# EAGLE design Adapter-IO4-200 (EAGLE 7.7.0)
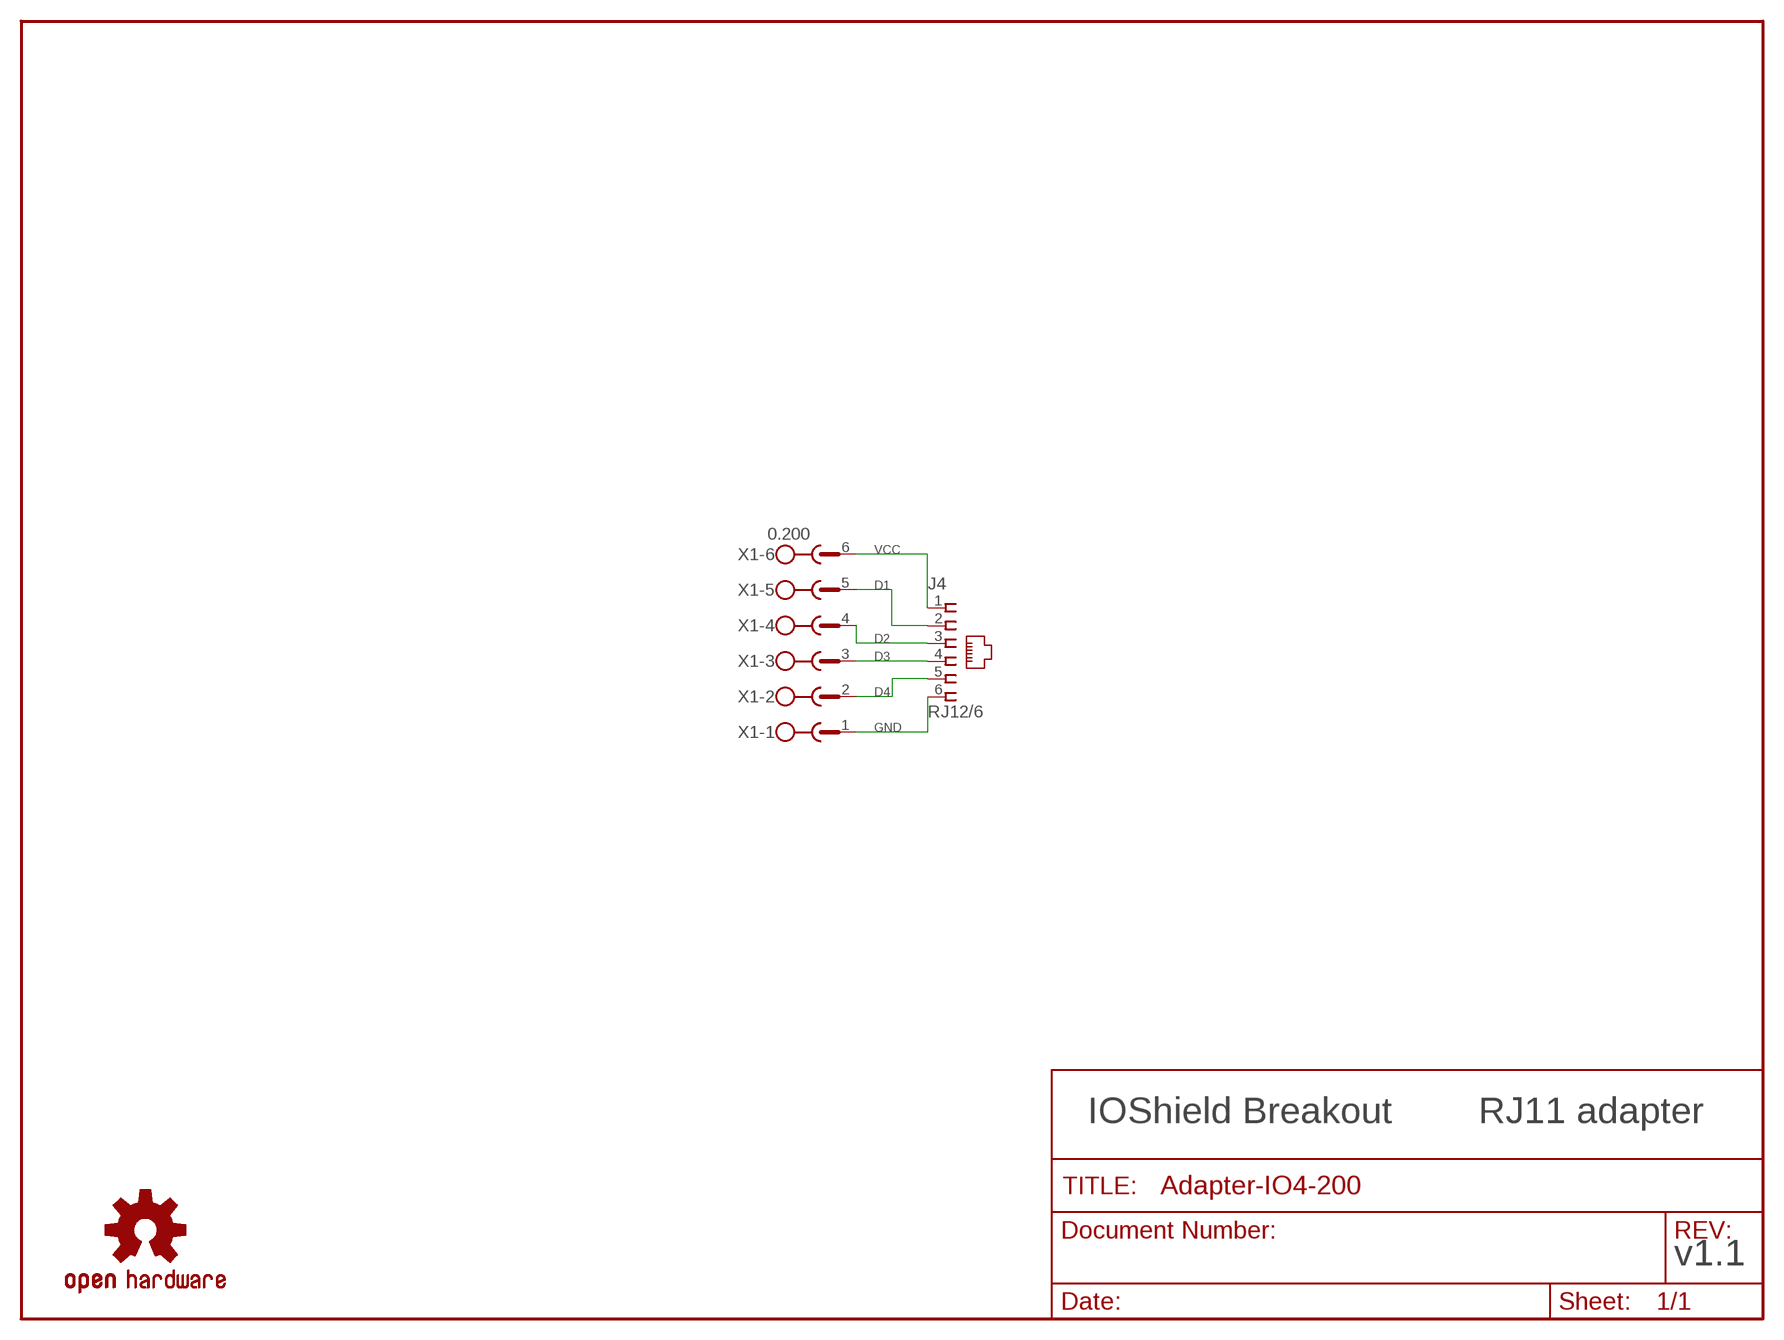
[diagram p0: schematic, sheet 1]

## Parts
J4  RJ12/6  CONNECTOR-RJ25-6P6C  [RJ25-PANEL]
U$1  OSHW  OSHW-LOGOM  [OSHW-LOGO-M]
X1  0.200  MSTBA6  [MSTBA6]

## Nets
D1: J4.2 X1.5
D2: J4.3 X1.4
D3: J4.4 X1.3
D4: J4.5 X1.2
GND [power]: J4.6 X1.1
VCC [power]: J4.1 X1.6

## Notes on the sheet
- IOShield Breakout | RJ11 adapter
- v1.1

## Library data of the parts
J4 = SPCoast:CONNECTOR-RJ25: AMP connector; AMP: 520250-3; OPL: none
U$1 = SparkFun:OSHW-LOGO: Open Source Hardware Logo This logo indicates the piece of hardware it is found on incorporates a OSHW license and/or adheres to the definition of open source hardware found here: http://freedomdefined.org/OSHW
X1 = con-phoenix-508:MSTBA6: PHOENIX; MF: FARNELL; MPN: 1757284; OC_FARNELL: 3705213; OC_NEWARK: 71C4165

## Net classes
0 default: width 0.508 mm
1 power: width 0.61 mm

## Board
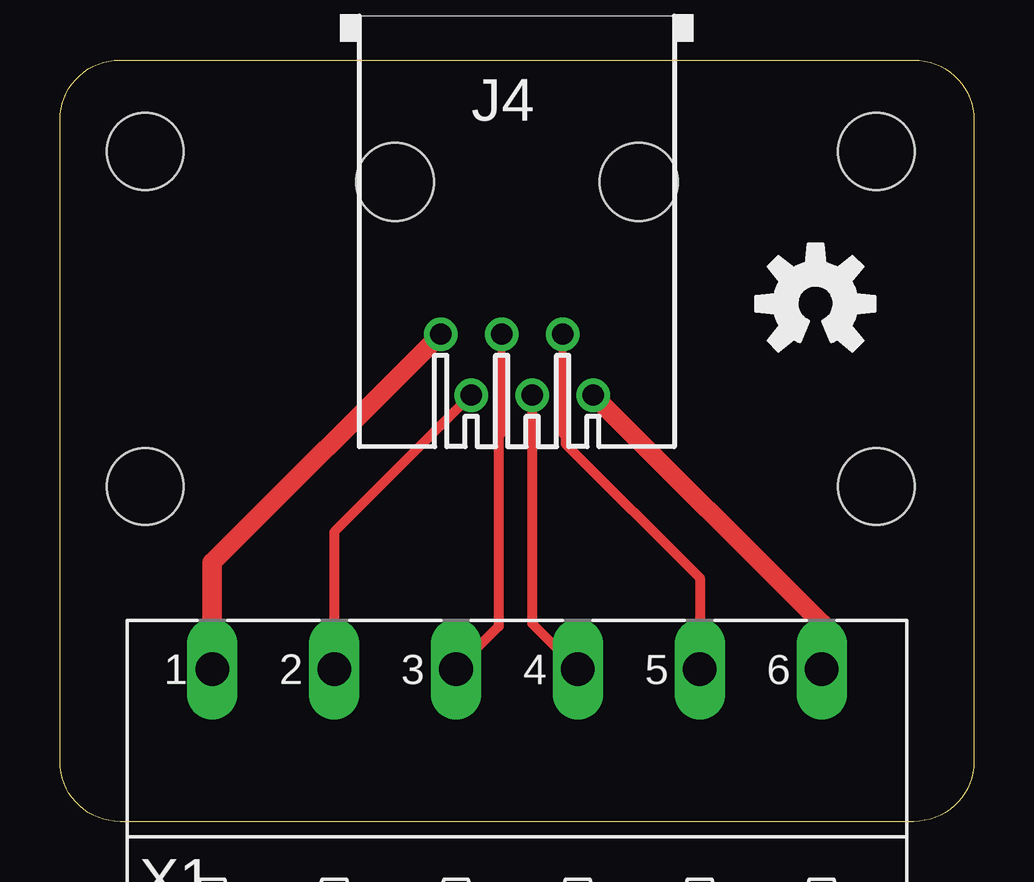
[diagram p1: board, top side]
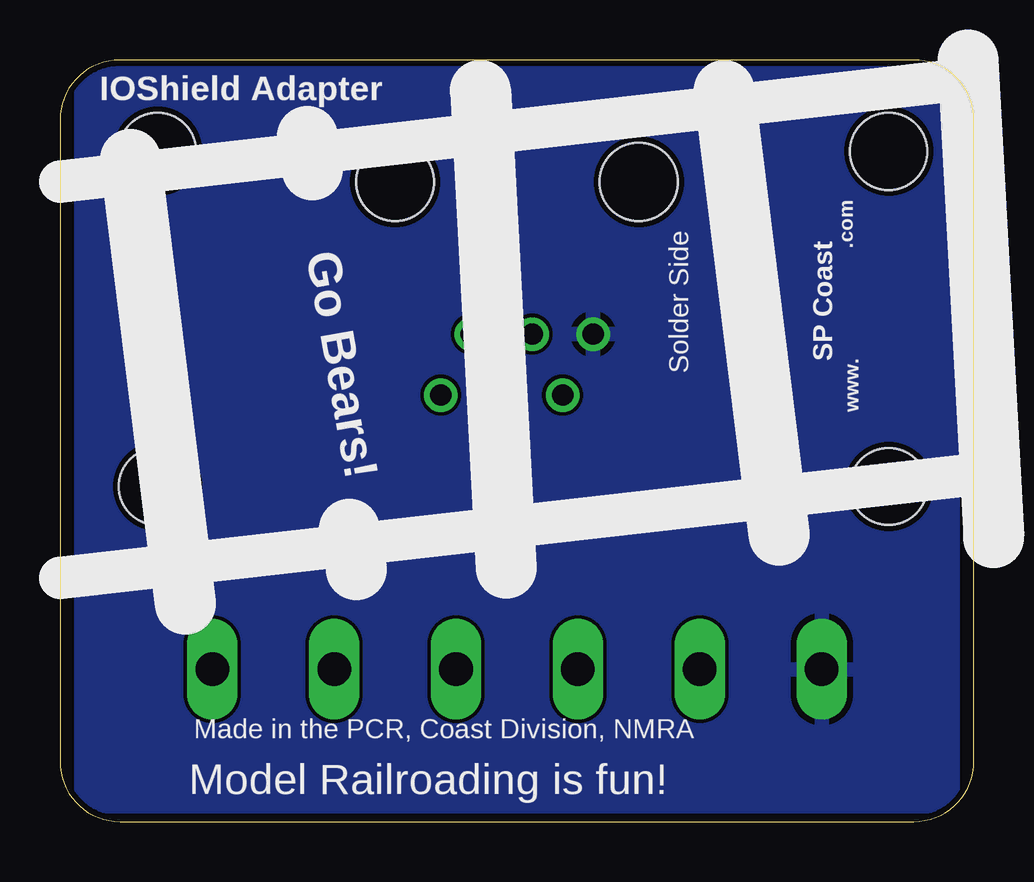
[diagram p2: board, bottom side, seen from below]

Size 38.1 x 31.75 mm. Coordinates in mm from the lower left corner, seen from the top.
Outline: 0,3.81 0,29.25 arc-90 2.5,31.75 26.67,31.75 35.6,31.75 arc-90 38.1,29.25 38.1,5.08 38.1,2.5 arc-90 35.6,0 7.62,0 2.5,0 arc-90 0,2.5 0,3.81
Copper layers (1*16): Top 0.035mm / dielectric 1.5mm / Bottom 0.035mm
Design rules "Fusion_eagle_rule_v1.1": minimum track width 6mil, minimum drill 12mil, track to track 6mil, track to pad 6mil, pad to pad 6mil, via to via 6mil, smd to smd 0mil, copper to edge 10mil, drill to drill 10mil, minimum pad ring 10mil, minimum via ring 6mil, stop-mask expansion 2mil, vias tented up to drill 100mil, thermal gap 10mil
Holes 3.2 mm at 34.04,27.94 3.56,27.94 3.56,13.97 34.04,13.97

### Footprints (pad centres in the part's own frame; a part is rotated, then mirrored left to right if it is on the bottom)
RJ25-PANEL = drill 0.889: 1 -3.175,8.89; 2 -1.905,6.35; 3 -0.635,8.89; 4 0.635,6.35; 5 1.905,8.89; 6 3.175,6.35 | hole 3.251: -5.08,0; 5.08,0
MSTBA6 = drill 1.397 long: 1 -12.7,5.08; 2 -7.62,5.08; 3 -2.54,5.08; 4 2.54,5.08; 5 7.62,5.08; 6 12.7,5.08

### Placement (x,y rotation side)
J4  19.05,26.67 180 top
U$1  31.5,21.59 0 top
X1  19.05,1.27 0 top

### Tracks (layer width: path | path; a pad name or v marks a point on that pad's centre or on a via)
D1
  Top 0.305: J4.2 20.95,16.13 21.08,16
  Top 0.406: 21.08,16 21.08,15.75 26.67,10.16 X1.5
D2
  Top 0.406: J4.3 19.68,8.26 X1.4
D3
  Top 0.305: J4.4 18.41,16.13 18.29,16
  Top 0.406: 18.29,16 18.29,8.13 X1.3
D4
  Top 0.406: J4.5 11.43,12.06 X1.2
GND
  Top 0.813: J4.6 6.35,10.79 6.35,7.62 X1.1
  pour Bottom: 0.89,31.75 37.21,31.75 37.21,0.64 0.89,0.64
VCC
  Top 0.813: J4.1 31.75,8.26 X1.6

### Text on the board
bNames: IOShield Adapter | Solder Side | .com | SP Coast | www. | Go Bears! | Made in the PCR, Coast Division, NMRA | Model Railroading is fun!
Document: v1.1 | Breakout | Open Source | IO32 | Hardware | Gnd | 4 | 3 | 2 | 1 | V+ | John Plocher | 2013.05
tDocu: 0.200 pitch